# Altium schematic sheet LCD_UC1601.SchDoc
size A4; SheetNumber: 3; SheetTotal: 11
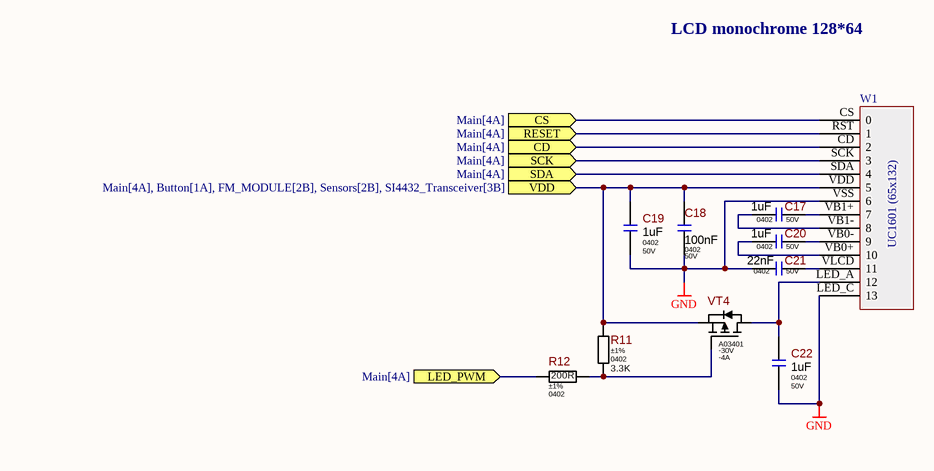
[diagram p0: LCD_UC1601.SchDoc]

## Parts
C17  Package: 0402  Voltage: 50V  [Cap_0402]  (hidden comment: 1uF)
C18  Package: 0402  Voltage: 50V  [Cap_0402]  (hidden comment: 100nF)
C19  Package: 0402  Voltage: 50V  [Cap_0402]  (hidden comment: 1uF)
C20  Package: 0402  Voltage: 50V  [Cap_0402]  (hidden comment: 1uF)
C21  Package: 0402  Voltage: 50V  [Cap_0402]  (hidden comment: 22nF)
C22  Package: 0402  Voltage: 50V  [Cap_0402]  (hidden comment: 1uF)
R11  value 3.3K  Tolerance: ±1%  Package: 0402  [Res_0402]  (hidden comment: Res_0402_3.3K)
R12  value 200R  Tolerance: ±1%  Package: 0402  [Res_0402]  (hidden comment: Res_0402_200R)
VT4  Vds: -30V  Id: -4A  [SOT-23]  (hidden comment: A03401)
W1  LCD_UC1601s  [LCD_connector_14PIN_0.5mm]  (value not drawn)

## Ports
CD (in, see Main[4A]), CS (in, see Main[4A]), LED_PWM (in, see Main[4A]), RESET (in, see Main[4A]), SCK (in, see Main[4A]), SDA (in, see Main[4A]), VDD (in, see Main[4A], Button[1A], FM_MODULE[2B], Sensors[2B], SI4432_Transceiver[3B])

## Nets
GND: C18.2 C19.2 C21.1 C22.2 W1.LED_C(13) W1.VSS(6)
CD: W1.CD(2) ; port CD
CS: W1.CS(0) ; port CS
LED_PWM: R12.1 ; port LED_PWM
RESET: W1.RST(1) ; port RESET
SCK: W1.SCK(3) ; port SCK
SDA: W1.SDA(4) ; port SDA
VDD: C18.1 C19.1 R11.2 VT4.2(S) W1.VDD(5) ; port VDD
NetC17_1: C17.1 W1.VB1-(8)
NetC17_2: C17.2 W1.VB1+(7)
NetC20_1: C20.1 W1.VB0+(10)
NetC20_2: C20.2 W1.VB0-(9)
NetC21_2: C21.2 W1.VLCD(11)
NetC22_1: C22.1 VT4.3(D) W1.LED_A(12)
NetR11_1: R11.1 R12.2 VT4.1(G)

## Notes on the sheet
- LCD monochrome 128*64
- (in symbol LCD_UC1601s) UC1601 (65x132)

## Library data of the parts
C17 C19 C20 C22 = Cap_0402_1uF: 1uF 50V  ±25% 0402 Ceramic Capacitor; Component Type: SMD; Tolerance: ±25%; ComponentLink1URL: https://search.murata.co.jp/Ceramy/image/img/A01X/G101/ENG/GRM31CR60J107ME39-01.pdf; ComponentLink1Description: Datasheet; Value: 1uF
C18 = Cap_0402_100nF: 100nF 50V  ±25% 0402 Ceramic Capacitor; Component Type: SMD; Tolerance: ±25%; ComponentLink1URL: https://search.murata.co.jp/Ceramy/image/img/A01X/G101/ENG/GRM31CR60J107ME39-01.pdf; ComponentLink1Description: Datasheet; Value: 100nF
C21 = Cap_0402_22nF: 22nF 50V  ±25% 0402 Ceramic Capacitor; Component Type: SMD; Tolerance: ±25%; ComponentLink1URL: https://search.murata.co.jp/Ceramy/image/img/A01X/G101/ENG/GRM31CR60J107ME39-01.pdf; ComponentLink1Description: Datasheet; Value: 22nF
R11 = Res_0402_3.3K: ±1% 1/16W 0402; Power Rating: 0.062W; Voltage: 50V; ComponentLink1URL: https://www.yageo.com/upload/media/product/productsearch/datasheet/rchip/PYu-RC_Group_51_RoHS_L_10.pdf; ComponentLink1Description: Datasheet
R12 = Res_0402_200R: ±1% 1/16W 0402; Power Rating: 0.062W; Voltage: 50V; ComponentLink1URL: https://www.yageo.com/upload/media/product/productsearch/datasheet/rchip/PYu-RC_Group_51_RoHS_L_10.pdf; ComponentLink1Description: Datasheet
VT4 = A03401: -30V, -4A max P-Channel  MOSFET, 60mOhm @ Vgs = -4.5V; Part Type: N-Channel; Component Type: SMD; ComponentLink1URL: https://datasheetspdf.com/pdf-file/767558/Alpha&OmegaSemiconductors/AO3416/1; ComponentLink1Description: Datasheet; Package: SOT-23; Rds: 60mOhm; Name: A03401